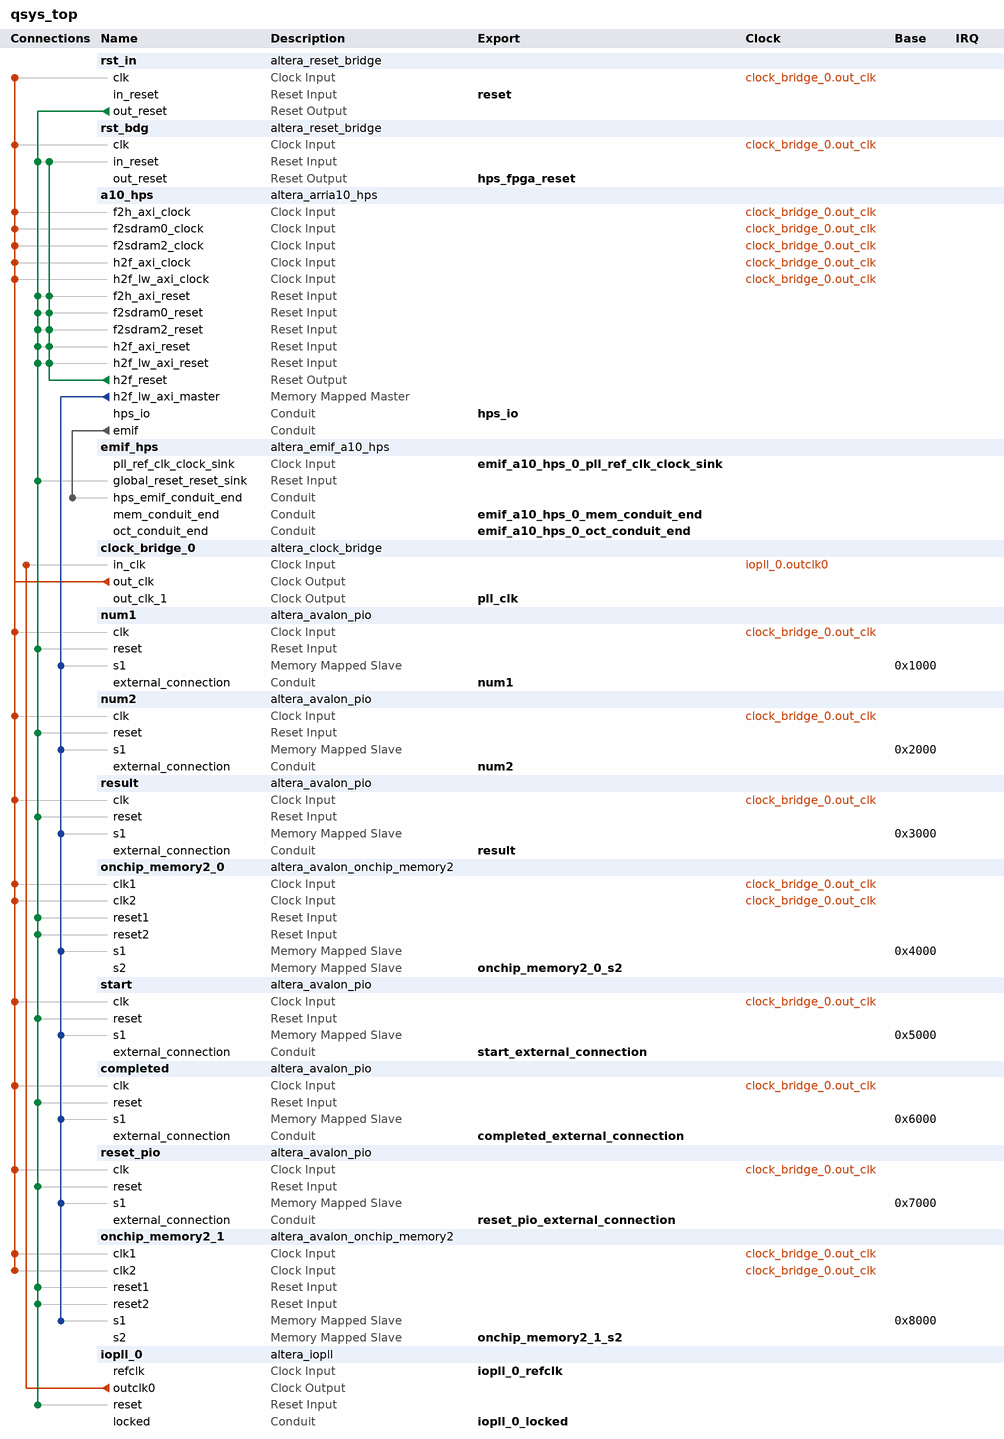
[diagram p0: system contents]
# Platform Designer (Qsys) system qsys_top, Arria 10 10AS066N3F40E2SG
# Parameters at their usual value, and those the tool derives, are not listed.
package require -exact qsys 1.0
create_system qsys_top
set_project_property DEVICE_FAMILY {Arria 10}
set_project_property DEVICE 10AS066N3F40E2SG

add_component rst_in ip/qsys_top/rst_in.ip altera_reset_bridge rst_in 18.1

add_component rst_bdg ip/qsys_top/rst_bdg.ip altera_reset_bridge rst_bdg 18.1
load_component rst_bdg
set_component_parameter_value ACTIVE_LOW_RESET 0
set_component_parameter_value SYNCHRONOUS_EDGES deassert
set_component_parameter_value SYNC_RESET 0
save_component

add_instance a10_hps altera_arria10_hps 18.1
set_instance_parameter_value a10_hps BOOT_FROM_FPGA_Enable false
set_instance_parameter_value a10_hps BSEL 1
set_instance_parameter_value a10_hps BSEL_EN false
set_instance_parameter_value a10_hps CLK_EMACA_SOURCE 1
set_instance_parameter_value a10_hps CLK_EMACB_SOURCE 1
set_instance_parameter_value a10_hps CLK_EMAC_PTP_SOURCE 1
set_instance_parameter_value a10_hps CLK_GPIO_SOURCE 1
set_instance_parameter_value a10_hps CLK_HMC_PLL_SOURCE 0
set_instance_parameter_value a10_hps CLK_MAIN_PLL_SOURCE2 0
set_instance_parameter_value a10_hps CLK_MPU_CNT 0
set_instance_parameter_value a10_hps CLK_MPU_SOURCE 0
set_instance_parameter_value a10_hps CLK_NOC_CNT 0
set_instance_parameter_value a10_hps CLK_NOC_SOURCE 0
set_instance_parameter_value a10_hps CLK_PERI_PLL_SOURCE2 0
set_instance_parameter_value a10_hps CLK_S2F_USER0_SOURCE 0
set_instance_parameter_value a10_hps CLK_S2F_USER1_SOURCE 0
set_instance_parameter_value a10_hps CLK_SDMMC_SOURCE 1
set_instance_parameter_value a10_hps CM_Mode N/A
set_instance_parameter_value a10_hps CM_PinMuxing Unused
set_instance_parameter_value a10_hps CTI_Enable false
set_instance_parameter_value a10_hps CUSTOM_MPU_CLK 1020
set_instance_parameter_value a10_hps DEBUG_APB_Enable false
set_instance_parameter_value a10_hps DISABLE_PERI_PLL false
set_instance_parameter_value a10_hps DMA_Enable No,No,No,No,No,No,No,No
set_instance_parameter_value a10_hps EMAC0_CLK 250
set_instance_parameter_value a10_hps EMAC0_Mode RGMII_with_MDIO
set_instance_parameter_value a10_hps EMAC0_PTP false
set_instance_parameter_value a10_hps EMAC0_PinMuxing IO
set_instance_parameter_value a10_hps EMAC0_SWITCH_Enable false
set_instance_parameter_value a10_hps EMAC1_CLK 250
set_instance_parameter_value a10_hps EMAC1_Mode N/A
set_instance_parameter_value a10_hps EMAC1_PTP false
set_instance_parameter_value a10_hps EMAC1_PinMuxing Unused
set_instance_parameter_value a10_hps EMAC1_SWITCH_Enable false
set_instance_parameter_value a10_hps EMAC2_CLK 250
set_instance_parameter_value a10_hps EMAC2_Mode N/A
set_instance_parameter_value a10_hps EMAC2_PTP false
set_instance_parameter_value a10_hps EMAC2_PinMuxing Unused
set_instance_parameter_value a10_hps EMAC2_SWITCH_Enable false
set_instance_parameter_value a10_hps EMAC_PTP_REF_CLK 100
set_instance_parameter_value a10_hps EMIF_BYPASS_CHECK false
set_instance_parameter_value a10_hps EMIF_CONDUIT_Enable true
set_instance_parameter_value a10_hps F2H_AXI_CLOCK_FREQ 140000000
set_instance_parameter_value a10_hps F2H_COLD_RST_Enable false
set_instance_parameter_value a10_hps F2H_DBG_RST_Enable false
set_instance_parameter_value a10_hps F2H_DELAY 3
set_instance_parameter_value a10_hps F2H_FREE_CLK_Enable false
set_instance_parameter_value a10_hps F2H_FREE_CLK_FREQ 200
set_instance_parameter_value a10_hps F2H_SDRAM0_CLOCK_FREQ 100
set_instance_parameter_value a10_hps F2H_SDRAM1_CLOCK_FREQ 100
set_instance_parameter_value a10_hps F2H_SDRAM2_CLOCK_FREQ 100
set_instance_parameter_value a10_hps F2H_SDRAM3_CLOCK_FREQ 100
set_instance_parameter_value a10_hps F2H_SDRAM4_CLOCK_FREQ 100
set_instance_parameter_value a10_hps F2H_SDRAM5_CLOCK_FREQ 100
set_instance_parameter_value a10_hps F2H_WARM_RST_Enable false
set_instance_parameter_value a10_hps F2SDRAM0_ENABLED true
set_instance_parameter_value a10_hps F2SDRAM1_ENABLED false
set_instance_parameter_value a10_hps F2SDRAM2_DELAY 4
set_instance_parameter_value a10_hps F2SDRAM2_ENABLED true
set_instance_parameter_value a10_hps F2SDRAM_ADDRESS_WIDTH 32
set_instance_parameter_value a10_hps F2SDRAM_PORT_CONFIG 6
set_instance_parameter_value a10_hps F2SDRAM_READY_LATENCY true
set_instance_parameter_value a10_hps F2SINTERRUPT_Enable false
set_instance_parameter_value a10_hps F2S_Width 6
set_instance_parameter_value a10_hps FPGA_PERIPHERAL_INPUT_CLOCK_FREQ_EMAC0_RX_CLK_IN 100
set_instance_parameter_value a10_hps FPGA_PERIPHERAL_INPUT_CLOCK_FREQ_EMAC0_TX_CLK_IN 100
set_instance_parameter_value a10_hps FPGA_PERIPHERAL_INPUT_CLOCK_FREQ_EMAC1_RX_CLK_IN 100
set_instance_parameter_value a10_hps FPGA_PERIPHERAL_INPUT_CLOCK_FREQ_EMAC1_TX_CLK_IN 100
set_instance_parameter_value a10_hps FPGA_PERIPHERAL_INPUT_CLOCK_FREQ_EMAC2_RX_CLK_IN 100
set_instance_parameter_value a10_hps FPGA_PERIPHERAL_INPUT_CLOCK_FREQ_EMAC2_TX_CLK_IN 100
set_instance_parameter_value a10_hps FPGA_PERIPHERAL_INPUT_CLOCK_FREQ_EMAC_PTP_REF_CLOCK 100
set_instance_parameter_value a10_hps FPGA_PERIPHERAL_INPUT_CLOCK_FREQ_I2C0_SCL_IN 100
set_instance_parameter_value a10_hps FPGA_PERIPHERAL_INPUT_CLOCK_FREQ_I2C1_SCL_IN 100
set_instance_parameter_value a10_hps FPGA_PERIPHERAL_INPUT_CLOCK_FREQ_I2CEMAC0_SCL_IN 100
set_instance_parameter_value a10_hps FPGA_PERIPHERAL_INPUT_CLOCK_FREQ_I2CEMAC1_SCL_IN 100
set_instance_parameter_value a10_hps FPGA_PERIPHERAL_INPUT_CLOCK_FREQ_I2CEMAC2_SCL_IN 100
set_instance_parameter_value a10_hps FPGA_PERIPHERAL_INPUT_CLOCK_FREQ_SDMMC_CLK_IN 100
set_instance_parameter_value a10_hps FPGA_PERIPHERAL_INPUT_CLOCK_FREQ_SPIS0_SCLK_IN 100
set_instance_parameter_value a10_hps FPGA_PERIPHERAL_INPUT_CLOCK_FREQ_SPIS1_SCLK_IN 100
set_instance_parameter_value a10_hps FPGA_PERIPHERAL_INPUT_CLOCK_FREQ_USB0_CLK_IN 100
set_instance_parameter_value a10_hps FPGA_PERIPHERAL_INPUT_CLOCK_FREQ_USB1_CLK_IN 100
set_instance_parameter_value a10_hps FPGA_PERIPHERAL_OUTPUT_CLOCK_FREQ_EMAC0_GTX_CLK 100
set_instance_parameter_value a10_hps FPGA_PERIPHERAL_OUTPUT_CLOCK_FREQ_EMAC0_MD_CLK 2.5
set_instance_parameter_value a10_hps FPGA_PERIPHERAL_OUTPUT_CLOCK_FREQ_EMAC1_GTX_CLK 125
set_instance_parameter_value a10_hps FPGA_PERIPHERAL_OUTPUT_CLOCK_FREQ_EMAC1_MD_CLK 2.5
set_instance_parameter_value a10_hps FPGA_PERIPHERAL_OUTPUT_CLOCK_FREQ_EMAC2_GTX_CLK 125
set_instance_parameter_value a10_hps FPGA_PERIPHERAL_OUTPUT_CLOCK_FREQ_EMAC2_MD_CLK 2.5
set_instance_parameter_value a10_hps FPGA_PERIPHERAL_OUTPUT_CLOCK_FREQ_I2C0_CLK 100
set_instance_parameter_value a10_hps FPGA_PERIPHERAL_OUTPUT_CLOCK_FREQ_I2C1_CLK 100
set_instance_parameter_value a10_hps FPGA_PERIPHERAL_OUTPUT_CLOCK_FREQ_I2CEMAC0_CLK 100
set_instance_parameter_value a10_hps FPGA_PERIPHERAL_OUTPUT_CLOCK_FREQ_I2CEMAC1_CLK 100
set_instance_parameter_value a10_hps FPGA_PERIPHERAL_OUTPUT_CLOCK_FREQ_I2CEMAC2_CLK 100
set_instance_parameter_value a10_hps FPGA_PERIPHERAL_OUTPUT_CLOCK_FREQ_QSPI_SCLK_OUT 100
set_instance_parameter_value a10_hps FPGA_PERIPHERAL_OUTPUT_CLOCK_FREQ_SDMMC_CCLK 100
set_instance_parameter_value a10_hps FPGA_PERIPHERAL_OUTPUT_CLOCK_FREQ_SPIM0_SCLK_OUT 100
set_instance_parameter_value a10_hps FPGA_PERIPHERAL_OUTPUT_CLOCK_FREQ_SPIM1_SCLK_OUT 100
set_instance_parameter_value a10_hps GPIO_REF_CLK 4
set_instance_parameter_value a10_hps GP_Enable false
set_instance_parameter_value a10_hps H2F_AXI_CLOCK_FREQ 140000000
set_instance_parameter_value a10_hps H2F_COLD_RST_Enable false
set_instance_parameter_value a10_hps H2F_CTI_CLOCK_FREQ 100
set_instance_parameter_value a10_hps H2F_DEBUG_APB_CLOCK_FREQ 100
set_instance_parameter_value a10_hps H2F_DELAY 3
set_instance_parameter_value a10_hps H2F_LW_AXI_CLOCK_FREQ 140000000
set_instance_parameter_value a10_hps H2F_LW_DELAY 3
set_instance_parameter_value a10_hps H2F_PENDING_RST_Enable false
set_instance_parameter_value a10_hps H2F_TPIU_CLOCK_IN_FREQ 100
set_instance_parameter_value a10_hps H2F_USER0_CLK_Enable false
set_instance_parameter_value a10_hps H2F_USER0_CLK_FREQ 400
set_instance_parameter_value a10_hps H2F_USER1_CLK_Enable false
set_instance_parameter_value a10_hps H2F_USER1_CLK_FREQ 400
set_instance_parameter_value a10_hps HMC_PLL_REF_CLK 800
set_instance_parameter_value a10_hps HPS_DIV_GPIO_FREQ 125
set_instance_parameter_value a10_hps HPS_IO_Enable SDMMC:D0,SDMMC:CMD,SDMMC:CCLK,SDMMC:D1,SDMMC:D2,SDMMC:D3,NONE,NONE,SDMMC:D4,SDMMC:D5,SDMMC:D6,SDMMC:D7,UART1:TX,UART1:RX,USB0:CLK,USB0:STP,USB0:DIR,USB0:DATA0,USB0:DATA1,USB0:NXT,USB0:DATA2,USB0:DATA3,USB0:DATA4,USB0:DATA5,USB0:DATA6,USB0:DATA7,EMAC0:TX_CLK,EMAC0:TX_CTL,EMAC0:RX_CLK,EMAC0:RX_CTL,EMAC0:TXD0,EMAC0:TXD1,EMAC0:RXD0,EMAC0:RXD1,EMAC0:TXD2,EMAC0:TXD3,EMAC0:RXD2,EMAC0:RXD3,SPIM1:CLK,SPIM1:MOSI,SPIM1:MISO,SPIM1:SS0_N,SPIM1:SS1_N,GPIO,NONE,NONE,NONE,NONE,MDIO0:MDIO,MDIO0:MDC,I2C1:SDA,I2C1:SCL,GPIO,TRACE:CLK,GPIO,GPIO,NONE,NONE,TRACE:D0,TRACE:D1,TRACE:D2,TRACE:D3
set_instance_parameter_value a10_hps I2C0_Mode N/A
set_instance_parameter_value a10_hps I2C0_PinMuxing Unused
set_instance_parameter_value a10_hps I2C1_Mode default
set_instance_parameter_value a10_hps I2C1_PinMuxing IO
set_instance_parameter_value a10_hps I2CEMAC0_Mode N/A
set_instance_parameter_value a10_hps I2CEMAC0_PinMuxing Unused
set_instance_parameter_value a10_hps I2CEMAC1_Mode N/A
set_instance_parameter_value a10_hps I2CEMAC1_PinMuxing Unused
set_instance_parameter_value a10_hps I2CEMAC2_Mode N/A
set_instance_parameter_value a10_hps I2CEMAC2_PinMuxing Unused
set_instance_parameter_value a10_hps INTERNAL_OSCILLATOR_ENABLE 60
set_instance_parameter_value a10_hps JTAG_Enable false
set_instance_parameter_value a10_hps L3_MAIN_FREE_CLK 200
set_instance_parameter_value a10_hps L4_SYS_FREE_CLK 1
set_instance_parameter_value a10_hps LWH2F_Enable 2
set_instance_parameter_value a10_hps MPU_CLK_VCCL 1
set_instance_parameter_value a10_hps MPU_EVENTS_Enable false
set_instance_parameter_value a10_hps NAND_Mode N/A
set_instance_parameter_value a10_hps NAND_PinMuxing Unused
set_instance_parameter_value a10_hps NOCDIV_CS_ATCLK 0
set_instance_parameter_value a10_hps NOCDIV_CS_PDBGCLK 1
set_instance_parameter_value a10_hps NOCDIV_CS_TRACECLK 1
set_instance_parameter_value a10_hps NOCDIV_L4MAINCLK 0
set_instance_parameter_value a10_hps NOCDIV_L4MPCLK 0
set_instance_parameter_value a10_hps NOCDIV_L4SPCLK 2
set_instance_parameter_value a10_hps OVERIDE_PERI_PLL false
set_instance_parameter_value a10_hps PERI_PLL_MANUAL_VCO_FREQ 2000
set_instance_parameter_value a10_hps PLL_CLK0 Unused
set_instance_parameter_value a10_hps PLL_CLK1 Unused
set_instance_parameter_value a10_hps PLL_CLK2 Unused
set_instance_parameter_value a10_hps PLL_CLK3 Unused
set_instance_parameter_value a10_hps PLL_CLK4 Unused
set_instance_parameter_value a10_hps QSPI_Mode N/A
set_instance_parameter_value a10_hps QSPI_PinMuxing Unused
set_instance_parameter_value a10_hps RUN_INTERNAL_BUILD_CHECKS 0
set_instance_parameter_value a10_hps S2FINTERRUPT_CLOCKPERIPHERAL_Enable false
set_instance_parameter_value a10_hps S2FINTERRUPT_CTI_Enable false
set_instance_parameter_value a10_hps S2FINTERRUPT_DMA_Enable false
set_instance_parameter_value a10_hps S2FINTERRUPT_EMAC0_Enable false
set_instance_parameter_value a10_hps S2FINTERRUPT_EMAC1_Enable false
set_instance_parameter_value a10_hps S2FINTERRUPT_EMAC2_Enable false
set_instance_parameter_value a10_hps S2FINTERRUPT_FPGAMANAGER_Enable false
set_instance_parameter_value a10_hps S2FINTERRUPT_GPIO_Enable false
set_instance_parameter_value a10_hps S2FINTERRUPT_HMC_Enable false
set_instance_parameter_value a10_hps S2FINTERRUPT_I2C0_Enable false
set_instance_parameter_value a10_hps S2FINTERRUPT_I2C1_Enable false
set_instance_parameter_value a10_hps S2FINTERRUPT_I2CEMAC0_Enable false
set_instance_parameter_value a10_hps S2FINTERRUPT_I2CEMAC1_Enable false
set_instance_parameter_value a10_hps S2FINTERRUPT_I2CEMAC2_Enable false
set_instance_parameter_value a10_hps S2FINTERRUPT_L4TIMER_Enable false
set_instance_parameter_value a10_hps S2FINTERRUPT_NAND_Enable false
set_instance_parameter_value a10_hps S2FINTERRUPT_QSPI_Enable false
set_instance_parameter_value a10_hps S2FINTERRUPT_SDMMC_Enable false
set_instance_parameter_value a10_hps S2FINTERRUPT_SPIM0_Enable false
set_instance_parameter_value a10_hps S2FINTERRUPT_SPIM1_Enable false
set_instance_parameter_value a10_hps S2FINTERRUPT_SPIS0_Enable false
set_instance_parameter_value a10_hps S2FINTERRUPT_SPIS1_Enable false
set_instance_parameter_value a10_hps S2FINTERRUPT_SYSTEMMANAGER_Enable false
set_instance_parameter_value a10_hps S2FINTERRUPT_SYSTIMER_Enable false
set_instance_parameter_value a10_hps S2FINTERRUPT_UART0_Enable false
set_instance_parameter_value a10_hps S2FINTERRUPT_UART1_Enable false
set_instance_parameter_value a10_hps S2FINTERRUPT_USB0_Enable false
set_instance_parameter_value a10_hps S2FINTERRUPT_USB1_Enable false
set_instance_parameter_value a10_hps S2FINTERRUPT_WATCHDOG_Enable false
set_instance_parameter_value a10_hps S2F_Width 4
set_instance_parameter_value a10_hps SDMMC_Mode 8-bit
set_instance_parameter_value a10_hps SDMMC_PinMuxing IO
set_instance_parameter_value a10_hps SDMMC_REF_CLK 200
set_instance_parameter_value a10_hps SECURITY_MODULE_Enable false
set_instance_parameter_value a10_hps SPIM0_Mode N/A
set_instance_parameter_value a10_hps SPIM0_PinMuxing Unused
set_instance_parameter_value a10_hps SPIM1_Mode Dual_slave_selects
set_instance_parameter_value a10_hps SPIM1_PinMuxing IO
set_instance_parameter_value a10_hps SPIS0_Mode N/A
set_instance_parameter_value a10_hps SPIS0_PinMuxing Unused
set_instance_parameter_value a10_hps SPIS1_Mode N/A
set_instance_parameter_value a10_hps SPIS1_PinMuxing Unused
set_instance_parameter_value a10_hps STM_Enable false
set_instance_parameter_value a10_hps TESTIOCTRL_DEBUGCLKSEL 16
set_instance_parameter_value a10_hps TESTIOCTRL_MAINCLKSEL 8
set_instance_parameter_value a10_hps TESTIOCTRL_PERICLKSEL 8
set_instance_parameter_value a10_hps TEST_Enable false
set_instance_parameter_value a10_hps TRACE_Mode default
set_instance_parameter_value a10_hps TRACE_PinMuxing IO
set_instance_parameter_value a10_hps UART0_Mode N/A
set_instance_parameter_value a10_hps UART0_PinMuxing Unused
set_instance_parameter_value a10_hps UART1_Mode No_flow_control
set_instance_parameter_value a10_hps UART1_PinMuxing IO
set_instance_parameter_value a10_hps USB0_Mode default
set_instance_parameter_value a10_hps USB0_PinMuxing IO
set_instance_parameter_value a10_hps USB1_Mode N/A
set_instance_parameter_value a10_hps USB1_PinMuxing Unused
set_instance_parameter_value a10_hps USE_DEFAULT_MPU_CLK false
set_instance_parameter_value a10_hps device_name 10AS066N3F40E2SG
set_instance_parameter_value a10_hps eosc1_clk_mhz 25.0
set_instance_parameter_value a10_hps quartus_ini_hps_ip_boot_from_fpga_ready false
set_instance_parameter_value a10_hps quartus_ini_hps_ip_enable_a10_advanced_options false
set_instance_parameter_value a10_hps quartus_ini_hps_ip_enable_jtag false
set_instance_parameter_value a10_hps quartus_ini_hps_ip_enable_sdmmc_clk_in false
set_instance_parameter_value a10_hps quartus_ini_hps_ip_enable_test_interface false
set_instance_parameter_value a10_hps quartus_ini_hps_ip_overide_f2sdram_delay false
set_instance_parameter_value a10_hps quartus_ini_hps_ip_override_sdmmc_4bit false

add_component emif_hps ip/qsys_top/emif_hps.ip altera_emif_a10_hps emif_hps 18.1
load_component emif_hps
set_component_parameter_value FAMILY_ENUM FAMILY_ARRIA10_HPS
set_component_parameter_value TRAIT_SUPPORTS_VID 0
set_component_parameter_value PROTOCOL_ENUM PROTOCOL_DDR4
set_component_parameter_value IS_ED_SLAVE false
set_component_parameter_value INTERNAL_TESTING_MODE false
set_component_parameter_value CAL_DEBUG_CLOCK_FREQUENCY 50000000
set_component_parameter_value PREV_PROTOCOL_ENUM PROTOCOL_DDR4
set_component_parameter_value PHY_FPGA_SPEEDGRADE_GUI {E2 (Production) - change device under 'View'->'Device Family'}
set_component_parameter_value PHY_TARGET_SPEEDGRADE E2
set_component_parameter_value PHY_TARGET_IS_ES false
set_component_parameter_value PHY_TARGET_IS_ES2 false
set_component_parameter_value PHY_TARGET_IS_ES3 false
set_component_parameter_value PHY_TARGET_IS_PRODUCTION true
set_component_parameter_value PHY_CONFIG_ENUM CONFIG_PHY_AND_HARD_CTRL
set_component_parameter_value PHY_PING_PONG_EN false
set_component_parameter_value PHY_RATE_ENUM RATE_HALF
set_component_parameter_value PHY_MEM_CLK_FREQ_MHZ 1066.667
set_component_parameter_value PHY_REF_CLK_FREQ_MHZ 133.333
set_component_parameter_value PHY_REF_CLK_JITTER_PS 10.0
set_component_parameter_value PHY_CORE_CLKS_SHARING_ENUM CORE_CLKS_SHARING_DISABLED
set_component_parameter_value PHY_CORE_CLKS_SHARING_EXPOSE_SLAVE_OUT false
set_component_parameter_value PHY_CALIBRATED_OCT true
set_component_parameter_value PHY_AC_CALIBRATED_OCT true
set_component_parameter_value PHY_CK_CALIBRATED_OCT true
set_component_parameter_value PHY_DATA_CALIBRATED_OCT true
set_component_parameter_value PHY_RZQ 240
set_component_parameter_value PHY_HPS_ENABLE_EARLY_RELEASE true
set_component_parameter_value PHY_USER_PERIODIC_OCT_RECAL_ENUM PERIODIC_OCT_RECAL_AUTO
set_component_parameter_value PHY_AC_IO_STD_ENUM IO_STD_SSTL_12
set_component_parameter_value PHY_CK_IO_STD_ENUM IO_STD_SSTL_12
set_component_parameter_value PHY_DATA_IO_STD_ENUM IO_STD_POD_12
set_component_parameter_value PHY_AC_MODE_ENUM OUT_OCT_40_CAL
set_component_parameter_value PHY_CK_MODE_ENUM OUT_OCT_40_CAL
set_component_parameter_value PHY_DATA_OUT_MODE_ENUM OUT_OCT_34_CAL
set_component_parameter_value PLL_ADD_EXTRA_CLKS false
set_component_parameter_value PLL_USER_NUM_OF_EXTRA_CLKS 0
set_component_parameter_value PLL_EXTRA_CLK_ACTUAL_FREQ_MHZ_GUI_0 0.0
set_component_parameter_value PLL_EXTRA_CLK_ACTUAL_PHASE_PS_GUI_0 0.0
set_component_parameter_value PLL_EXTRA_CLK_DESIRED_FREQ_MHZ_GUI_0 0.0
set_component_parameter_value PLL_EXTRA_CLK_PHASE_SHIFT_UNIT_GUI_0 ps
set_component_parameter_value PLL_EXTRA_CLK_DESIRED_PHASE_GUI_0 0.0
set_component_parameter_value PLL_EXTRA_CLK_ACTUAL_PHASE_DEG_GUI_0 0.0
set_component_parameter_value PLL_EXTRA_CLK_DESIRED_DUTY_CYCLE_GUI_0 50.0
set_component_parameter_value PLL_EXTRA_CLK_ACTUAL_DUTY_CYCLE_GUI_0 50.0
set_component_parameter_value PLL_EXTRA_CLK_ACTUAL_DUTY_CYCLE_0 50.0
set_component_parameter_value PLL_EXTRA_CLK_ACTUAL_FREQ_MHZ_GUI_1 0.0
set_component_parameter_value PLL_EXTRA_CLK_ACTUAL_PHASE_PS_GUI_1 0.0
set_component_parameter_value PLL_EXTRA_CLK_DESIRED_FREQ_MHZ_GUI_1 0.0
set_component_parameter_value PLL_EXTRA_CLK_PHASE_SHIFT_UNIT_GUI_1 ps
set_component_parameter_value PLL_EXTRA_CLK_DESIRED_PHASE_GUI_1 0.0
set_component_parameter_value PLL_EXTRA_CLK_ACTUAL_PHASE_DEG_GUI_1 0.0
set_component_parameter_value PLL_EXTRA_CLK_DESIRED_DUTY_CYCLE_GUI_1 50.0
set_component_parameter_value PLL_EXTRA_CLK_ACTUAL_DUTY_CYCLE_GUI_1 50.0
set_component_parameter_value PLL_EXTRA_CLK_ACTUAL_DUTY_CYCLE_1 50.0
set_component_parameter_value PLL_EXTRA_CLK_ACTUAL_FREQ_MHZ_GUI_2 0.0
set_component_parameter_value PLL_EXTRA_CLK_ACTUAL_PHASE_PS_GUI_2 0.0
set_component_parameter_value PLL_EXTRA_CLK_DESIRED_FREQ_MHZ_GUI_2 0.0
set_component_parameter_value PLL_EXTRA_CLK_PHASE_SHIFT_UNIT_GUI_2 ps
set_component_parameter_value PLL_EXTRA_CLK_DESIRED_PHASE_GUI_2 0.0
set_component_parameter_value PLL_EXTRA_CLK_ACTUAL_PHASE_DEG_GUI_2 0.0
set_component_parameter_value PLL_EXTRA_CLK_DESIRED_DUTY_CYCLE_GUI_2 50.0
set_component_parameter_value PLL_EXTRA_CLK_ACTUAL_DUTY_CYCLE_GUI_2 50.0
set_component_parameter_value PLL_EXTRA_CLK_ACTUAL_DUTY_CYCLE_2 50.0
set_component_parameter_value PLL_EXTRA_CLK_ACTUAL_FREQ_MHZ_GUI_3 0.0
set_component_parameter_value PLL_EXTRA_CLK_ACTUAL_PHASE_PS_GUI_3 0.0
set_component_parameter_value PLL_EXTRA_CLK_DESIRED_FREQ_MHZ_GUI_3 0.0
set_component_parameter_value PLL_EXTRA_CLK_PHASE_SHIFT_UNIT_GUI_3 ps
set_component_parameter_value PLL_EXTRA_CLK_DESIRED_PHASE_GUI_3 0.0
set_component_parameter_value PLL_EXTRA_CLK_ACTUAL_PHASE_DEG_GUI_3 0.0
set_component_parameter_value PLL_EXTRA_CLK_DESIRED_DUTY_CYCLE_GUI_3 50.0
set_component_parameter_value PLL_EXTRA_CLK_ACTUAL_DUTY_CYCLE_GUI_3 50.0
set_component_parameter_value PLL_EXTRA_CLK_ACTUAL_DUTY_CYCLE_3 50.0
set_component_parameter_value PLL_EXTRA_CLK_ACTUAL_FREQ_MHZ_GUI_4 0.0
set_component_parameter_value PLL_EXTRA_CLK_ACTUAL_PHASE_PS_GUI_4 0.0
set_component_parameter_value PLL_EXTRA_CLK_DESIRED_FREQ_MHZ_GUI_4 0.0
set_component_parameter_value PLL_EXTRA_CLK_PHASE_SHIFT_UNIT_GUI_4 ps
set_component_parameter_value PLL_EXTRA_CLK_DESIRED_PHASE_GUI_4 0.0
set_component_parameter_value PLL_EXTRA_CLK_ACTUAL_PHASE_DEG_GUI_4 0.0
set_component_parameter_value PLL_EXTRA_CLK_DESIRED_DUTY_CYCLE_GUI_4 50.0
set_component_parameter_value PLL_EXTRA_CLK_ACTUAL_DUTY_CYCLE_GUI_4 50.0
set_component_parameter_value PLL_EXTRA_CLK_ACTUAL_DUTY_CYCLE_4 50.0
set_component_parameter_value PLL_EXTRA_CLK_ACTUAL_FREQ_MHZ_GUI_5 0.0
set_component_parameter_value PLL_EXTRA_CLK_ACTUAL_PHASE_PS_GUI_5 0.0
set_component_parameter_value PLL_EXTRA_CLK_DESIRED_FREQ_MHZ_GUI_5 0.0
set_component_parameter_value PLL_EXTRA_CLK_PHASE_SHIFT_UNIT_GUI_5 ps
set_component_parameter_value PLL_EXTRA_CLK_DESIRED_PHASE_GUI_5 0.0
set_component_parameter_value PLL_EXTRA_CLK_ACTUAL_PHASE_DEG_GUI_5 0.0
set_component_parameter_value PLL_EXTRA_CLK_DESIRED_DUTY_CYCLE_GUI_5 50.0
set_component_parameter_value PLL_EXTRA_CLK_ACTUAL_DUTY_CYCLE_GUI_5 50.0
set_component_parameter_value PLL_EXTRA_CLK_ACTUAL_DUTY_CYCLE_5 50.0
set_component_parameter_value PLL_EXTRA_CLK_ACTUAL_FREQ_MHZ_GUI_6 0.0
set_component_parameter_value PLL_EXTRA_CLK_ACTUAL_PHASE_PS_GUI_6 0.0
set_component_parameter_value PLL_EXTRA_CLK_DESIRED_FREQ_MHZ_GUI_6 0.0
set_component_parameter_value PLL_EXTRA_CLK_PHASE_SHIFT_UNIT_GUI_6 ps
set_component_parameter_value PLL_EXTRA_CLK_DESIRED_PHASE_GUI_6 0.0
set_component_parameter_value PLL_EXTRA_CLK_ACTUAL_PHASE_DEG_GUI_6 0.0
set_component_parameter_value PLL_EXTRA_CLK_DESIRED_DUTY_CYCLE_GUI_6 50.0
set_component_parameter_value PLL_EXTRA_CLK_ACTUAL_DUTY_CYCLE_GUI_6 50.0
set_component_parameter_value PLL_EXTRA_CLK_ACTUAL_DUTY_CYCLE_6 50.0
set_component_parameter_value PLL_EXTRA_CLK_ACTUAL_FREQ_MHZ_GUI_7 0.0
set_component_parameter_value PLL_EXTRA_CLK_ACTUAL_PHASE_PS_GUI_7 0.0
set_component_parameter_value PLL_EXTRA_CLK_DESIRED_FREQ_MHZ_GUI_7 0.0
set_component_parameter_value PLL_EXTRA_CLK_PHASE_SHIFT_UNIT_GUI_7 ps
set_component_parameter_value PLL_EXTRA_CLK_DESIRED_PHASE_GUI_7 0.0
set_component_parameter_value PLL_EXTRA_CLK_ACTUAL_PHASE_DEG_GUI_7 0.0
set_component_parameter_value PLL_EXTRA_CLK_DESIRED_DUTY_CYCLE_GUI_7 50.0
set_component_parameter_value PLL_EXTRA_CLK_ACTUAL_DUTY_CYCLE_GUI_7 50.0
set_component_parameter_value PLL_EXTRA_CLK_ACTUAL_DUTY_CYCLE_7 50.0
set_component_parameter_value PLL_EXTRA_CLK_ACTUAL_FREQ_MHZ_GUI_8 0.0
set_component_parameter_value PLL_EXTRA_CLK_ACTUAL_PHASE_PS_GUI_8 0.0
set_component_parameter_value PLL_EXTRA_CLK_DESIRED_FREQ_MHZ_GUI_8 0.0
set_component_parameter_value PLL_EXTRA_CLK_PHASE_SHIFT_UNIT_GUI_8 ps
set_component_parameter_value PLL_EXTRA_CLK_DESIRED_PHASE_GUI_8 0.0
set_component_parameter_value PLL_EXTRA_CLK_ACTUAL_PHASE_DEG_GUI_8 0.0
set_component_parameter_value PLL_EXTRA_CLK_DESIRED_DUTY_CYCLE_GUI_8 50.0
set_component_parameter_value PLL_EXTRA_CLK_ACTUAL_DUTY_CYCLE_GUI_8 50.0
set_component_parameter_value PLL_EXTRA_CLK_ACTUAL_DUTY_CYCLE_8 50.0
set_component_parameter_value PLL_VCO_CLK_FREQ_MHZ 1066.667
set_component_parameter_value PLL_NUM_OF_EXTRA_CLKS 0
set_component_parameter_value PLL_EXTRA_CLK_ACTUAL_FREQ_MHZ_0 0.0
set_component_parameter_value PLL_EXTRA_CLK_ACTUAL_PHASE_PS_0 0.0
set_component_parameter_value PLL_EXTRA_CLK_ACTUAL_FREQ_MHZ_1 0.0
set_component_parameter_value PLL_EXTRA_CLK_ACTUAL_PHASE_PS_1 0.0
set_component_parameter_value PLL_EXTRA_CLK_ACTUAL_FREQ_MHZ_2 0.0
set_component_parameter_value PLL_EXTRA_CLK_ACTUAL_PHASE_PS_2 0.0
set_component_parameter_value PLL_EXTRA_CLK_ACTUAL_FREQ_MHZ_3 0.0
set_component_parameter_value PLL_EXTRA_CLK_ACTUAL_PHASE_PS_3 0.0
set_component_parameter_value PLL_EXTRA_CLK_ACTUAL_FREQ_MHZ_4 0.0
set_component_parameter_value PLL_EXTRA_CLK_ACTUAL_PHASE_PS_4 0.0
set_component_parameter_value PLL_EXTRA_CLK_ACTUAL_FREQ_MHZ_5 1066.667
set_component_parameter_value PLL_EXTRA_CLK_ACTUAL_PHASE_PS_5 0.0
set_component_parameter_value PLL_EXTRA_CLK_ACTUAL_FREQ_MHZ_6 1066.667
set_component_parameter_value PLL_EXTRA_CLK_ACTUAL_PHASE_PS_6 0.0
set_component_parameter_value PLL_EXTRA_CLK_ACTUAL_FREQ_MHZ_7 1066.667
set_component_parameter_value PLL_EXTRA_CLK_ACTUAL_PHASE_PS_7 0.0
set_component_parameter_value PLL_EXTRA_CLK_ACTUAL_FREQ_MHZ_8 1066.667
set_component_parameter_value PLL_EXTRA_CLK_ACTUAL_PHASE_PS_8 0.0
set_component_parameter_value PHY_DDR3_CONFIG_ENUM CONFIG_PHY_AND_HARD_CTRL
set_component_parameter_value PHY_DDR3_USER_PING_PONG_EN false
set_component_parameter_value PHY_DDR3_MEM_CLK_FREQ_MHZ 1066.667
set_component_parameter_value PHY_DDR3_DEFAULT_REF_CLK_FREQ true
set_component_parameter_value PHY_DDR3_USER_REF_CLK_FREQ_MHZ -1.0
set_component_parameter_value PHY_DDR3_REF_CLK_JITTER_PS 10.0
set_component_parameter_value PHY_DDR3_RATE_ENUM RATE_HALF
set_component_parameter_value PHY_DDR3_CORE_CLKS_SHARING_ENUM CORE_CLKS_SHARING_DISABLED
set_component_parameter_value PHY_DDR3_CORE_CLKS_SHARING_EXPOSE_SLAVE_OUT false
set_component_parameter_value PHY_DDR3_IO_VOLTAGE 1.5
set_component_parameter_value PHY_DDR3_DEFAULT_IO true
set_component_parameter_value PHY_DDR3_HPS_ENABLE_EARLY_RELEASE false
set_component_parameter_value PHY_DDR3_USER_PERIODIC_OCT_RECAL_ENUM PERIODIC_OCT_RECAL_AUTO
set_component_parameter_value PHY_DDR3_REF_CLK_FREQ_MHZ -1.0
set_component_parameter_value PHY_DDR3_PING_PONG_EN false
set_component_parameter_value PHY_DDR3_USER_AC_IO_STD_ENUM unset
set_component_parameter_value PHY_DDR3_USER_AC_MODE_ENUM unset
set_component_parameter_value PHY_DDR3_USER_AC_SLEW_RATE_ENUM SLEW_RATE_FAST
set_component_parameter_value PHY_DDR3_USER_CK_IO_STD_ENUM unset
set_component_parameter_value PHY_DDR3_USER_CK_MODE_ENUM unset
set_component_parameter_value PHY_DDR3_USER_CK_SLEW_RATE_ENUM SLEW_RATE_FAST
set_component_parameter_value PHY_DDR3_USER_DATA_IO_STD_ENUM unset
set_component_parameter_value PHY_DDR3_USER_DATA_OUT_MODE_ENUM unset
set_component_parameter_value PHY_DDR3_USER_DATA_IN_MODE_ENUM unset
set_component_parameter_value PHY_DDR3_USER_AUTO_STARTING_VREFIN_EN true
set_component_parameter_value PHY_DDR3_USER_STARTING_VREFIN 70.0
set_component_parameter_value PHY_DDR3_USER_PLL_REF_CLK_IO_STD_ENUM unset
set_component_parameter_value PHY_DDR3_USER_RZQ_IO_STD_ENUM unset
set_component_parameter_value PHY_DDR3_AC_IO_STD_ENUM unset
set_component_parameter_value PHY_DDR3_AC_MODE_ENUM unset
set_component_parameter_value PHY_DDR3_AC_SLEW_RATE_ENUM SLEW_RATE_FAST
set_component_parameter_value PHY_DDR3_CK_IO_STD_ENUM unset
set_component_parameter_value PHY_DDR3_CK_MODE_ENUM unset
set_component_parameter_value PHY_DDR3_CK_SLEW_RATE_ENUM SLEW_RATE_FAST
set_component_parameter_value PHY_DDR3_DATA_IO_STD_ENUM unset
set_component_parameter_value PHY_DDR3_DATA_OUT_MODE_ENUM unset
set_component_parameter_value PHY_DDR3_DATA_IN_MODE_ENUM unset
set_component_parameter_value PHY_DDR3_AUTO_STARTING_VREFIN_EN true
set_component_parameter_value PHY_DDR3_STARTING_VREFIN 70.0
set_component_parameter_value PHY_DDR3_PLL_REF_CLK_IO_STD_ENUM unset
set_component_parameter_value PHY_DDR3_RZQ_IO_STD_ENUM unset
set_component_parameter_value PHY_DDR3_CAL_ADDR0 0
set_component_parameter_value PHY_DDR3_CAL_ADDR1 8
set_component_parameter_value PHY_DDR3_CAL_ENABLE_NON_DES false
set_component_parameter_value PHY_DDR4_CONFIG_ENUM CONFIG_PHY_AND_HARD_CTRL
set_component_parameter_value PHY_DDR4_USER_PING_PONG_EN false
set_component_parameter_value PHY_DDR4_MEM_CLK_FREQ_MHZ 1066.667
set_component_parameter_value PHY_DDR4_DEFAULT_REF_CLK_FREQ false
set_component_parameter_value PHY_DDR4_USER_REF_CLK_FREQ_MHZ 133.333
set_component_parameter_value PHY_DDR4_REF_CLK_JITTER_PS 10.0
set_component_parameter_value PHY_DDR4_RATE_ENUM RATE_HALF
set_component_parameter_value PHY_DDR4_CORE_CLKS_SHARING_ENUM CORE_CLKS_SHARING_DISABLED
set_component_parameter_value PHY_DDR4_CORE_CLKS_SHARING_EXPOSE_SLAVE_OUT false
set_component_parameter_value PHY_DDR4_IO_VOLTAGE 1.2
set_component_parameter_value PHY_DDR4_DEFAULT_IO false
set_component_parameter_value PHY_DDR4_HPS_ENABLE_EARLY_RELEASE true
set_component_parameter_value PHY_DDR4_USER_PERIODIC_OCT_RECAL_ENUM PERIODIC_OCT_RECAL_AUTO
set_component_parameter_value PHY_DDR4_REF_CLK_FREQ_MHZ 133.333
set_component_parameter_value PHY_DDR4_PING_PONG_EN false
set_component_parameter_value PHY_DDR4_USER_AC_IO_STD_ENUM IO_STD_SSTL_12
set_component_parameter_value PHY_DDR4_USER_AC_MODE_ENUM OUT_OCT_40_CAL
set_component_parameter_value PHY_DDR4_USER_AC_SLEW_RATE_ENUM SLEW_RATE_FAST
set_component_parameter_value PHY_DDR4_USER_CK_IO_STD_ENUM IO_STD_SSTL_12
set_component_parameter_value PHY_DDR4_USER_CK_MODE_ENUM OUT_OCT_40_CAL
set_component_parameter_value PHY_DDR4_USER_CK_SLEW_RATE_ENUM SLEW_RATE_FAST
set_component_parameter_value PHY_DDR4_USER_DATA_IO_STD_ENUM IO_STD_POD_12
set_component_parameter_value PHY_DDR4_USER_DATA_OUT_MODE_ENUM OUT_OCT_34_CAL
set_component_parameter_value PHY_DDR4_USER_DATA_IN_MODE_ENUM IN_OCT_60_CAL
set_component_parameter_value PHY_DDR4_USER_AUTO_STARTING_VREFIN_EN true
set_component_parameter_value PHY_DDR4_USER_STARTING_VREFIN 70.0
set_component_parameter_value PHY_DDR4_USER_PLL_REF_CLK_IO_STD_ENUM IO_STD_LVDS
set_component_parameter_value PHY_DDR4_USER_RZQ_IO_STD_ENUM IO_STD_CMOS_12
set_component_parameter_value PHY_DDR4_AC_IO_STD_ENUM IO_STD_SSTL_12
set_component_parameter_value PHY_DDR4_AC_MODE_ENUM OUT_OCT_40_CAL
set_component_parameter_value PHY_DDR4_AC_SLEW_RATE_ENUM SLEW_RATE_FAST
set_component_parameter_value PHY_DDR4_CK_IO_STD_ENUM IO_STD_SSTL_12
set_component_parameter_value PHY_DDR4_CK_MODE_ENUM OUT_OCT_40_CAL
set_component_parameter_value PHY_DDR4_CK_SLEW_RATE_ENUM SLEW_RATE_FAST
set_component_parameter_value PHY_DDR4_DATA_IO_STD_ENUM IO_STD_POD_12
set_component_parameter_value PHY_DDR4_DATA_OUT_MODE_ENUM OUT_OCT_34_CAL
set_component_parameter_value PHY_DDR4_DATA_IN_MODE_ENUM IN_OCT_60_CAL
set_component_parameter_value PHY_DDR4_AUTO_STARTING_VREFIN_EN true
set_component_parameter_value PHY_DDR4_STARTING_VREFIN 68.0
set_component_parameter_value PHY_DDR4_PLL_REF_CLK_IO_STD_ENUM IO_STD_LVDS
set_component_parameter_value PHY_DDR4_RZQ_IO_STD_ENUM IO_STD_CMOS_12
set_component_parameter_value PHY_QDR2_CONFIG_ENUM CONFIG_PHY_AND_SOFT_CTRL
set_component_parameter_value PHY_QDR2_USER_PING_PONG_EN false
set_component_parameter_value PHY_QDR2_MEM_CLK_FREQ_MHZ 633.333
set_component_parameter_value PHY_QDR2_DEFAULT_REF_CLK_FREQ true
set_component_parameter_value PHY_QDR2_USER_REF_CLK_FREQ_MHZ -1.0
set_component_parameter_value PHY_QDR2_REF_CLK_JITTER_PS 10.0
set_component_parameter_value PHY_QDR2_RATE_ENUM RATE_HALF
set_component_parameter_value PHY_QDR2_CORE_CLKS_SHARING_ENUM CORE_CLKS_SHARING_DISABLED
set_component_parameter_value PHY_QDR2_CORE_CLKS_SHARING_EXPOSE_SLAVE_OUT false
set_component_parameter_value PHY_QDR2_IO_VOLTAGE 1.5
set_component_parameter_value PHY_QDR2_DEFAULT_IO true
set_component_parameter_value PHY_QDR2_HPS_ENABLE_EARLY_RELEASE false
set_component_parameter_value PHY_QDR2_USER_PERIODIC_OCT_RECAL_ENUM PERIODIC_OCT_RECAL_AUTO
set_component_parameter_value PHY_QDR2_REF_CLK_FREQ_MHZ -1.0
set_component_parameter_value PHY_QDR2_PING_PONG_EN false
set_component_parameter_value PHY_QDR2_USER_AC_IO_STD_ENUM unset
set_component_parameter_value PHY_QDR2_USER_AC_MODE_ENUM unset
set_component_parameter_value PHY_QDR2_USER_AC_SLEW_RATE_ENUM SLEW_RATE_FAST
set_component_parameter_value PHY_QDR2_USER_CK_IO_STD_ENUM unset
set_component_parameter_value PHY_QDR2_USER_CK_MODE_ENUM unset
set_component_parameter_value PHY_QDR2_USER_CK_SLEW_RATE_ENUM SLEW_RATE_FAST
set_component_parameter_value PHY_QDR2_USER_DATA_IO_STD_ENUM unset
set_component_parameter_value PHY_QDR2_USER_DATA_OUT_MODE_ENUM unset
set_component_parameter_value PHY_QDR2_USER_DATA_IN_MODE_ENUM unset
set_component_parameter_value PHY_QDR2_USER_AUTO_STARTING_VREFIN_EN true
set_component_parameter_value PHY_QDR2_USER_STARTING_VREFIN 70.0
set_component_parameter_value PHY_QDR2_USER_PLL_REF_CLK_IO_STD_ENUM unset
set_component_parameter_value PHY_QDR2_USER_RZQ_IO_STD_ENUM unset
set_component_parameter_value PHY_QDR2_AC_IO_STD_ENUM unset
set_component_parameter_value PHY_QDR2_AC_MODE_ENUM unset
set_component_parameter_value PHY_QDR2_AC_SLEW_RATE_ENUM SLEW_RATE_FAST
set_component_parameter_value PHY_QDR2_CK_IO_STD_ENUM unset
set_component_parameter_value PHY_QDR2_CK_MODE_ENUM unset
set_component_parameter_value PHY_QDR2_CK_SLEW_RATE_ENUM SLEW_RATE_FAST
set_component_parameter_value PHY_QDR2_DATA_IO_STD_ENUM unset
set_component_parameter_value PHY_QDR2_DATA_OUT_MODE_ENUM unset
set_component_parameter_value PHY_QDR2_DATA_IN_MODE_ENUM unset
set_component_parameter_value PHY_QDR2_AUTO_STARTING_VREFIN_EN true
set_component_parameter_value PHY_QDR2_STARTING_VREFIN 70.0
set_component_parameter_value PHY_QDR2_PLL_REF_CLK_IO_STD_ENUM unset
set_component_parameter_value PHY_QDR2_RZQ_IO_STD_ENUM unset
set_component_parameter_value PHY_QDR4_CONFIG_ENUM CONFIG_PHY_AND_SOFT_CTRL
set_component_parameter_value PHY_QDR4_USER_PING_PONG_EN false
set_component_parameter_value PHY_QDR4_MEM_CLK_FREQ_MHZ 1066.667
set_component_parameter_value PHY_QDR4_DEFAULT_REF_CLK_FREQ true
set_component_parameter_value PHY_QDR4_USER_REF_CLK_FREQ_MHZ -1.0
set_component_parameter_value PHY_QDR4_REF_CLK_JITTER_PS 10.0
set_component_parameter_value PHY_QDR4_RATE_ENUM RATE_QUARTER
set_component_parameter_value PHY_QDR4_CORE_CLKS_SHARING_ENUM CORE_CLKS_SHARING_DISABLED
set_component_parameter_value PHY_QDR4_CORE_CLKS_SHARING_EXPOSE_SLAVE_OUT false
set_component_parameter_value PHY_QDR4_IO_VOLTAGE 1.2
set_component_parameter_value PHY_QDR4_DEFAULT_IO true
set_component_parameter_value PHY_QDR4_HPS_ENABLE_EARLY_RELEASE false
set_component_parameter_value PHY_QDR4_USER_PERIODIC_OCT_RECAL_ENUM PERIODIC_OCT_RECAL_AUTO
set_component_parameter_value PHY_QDR4_REF_CLK_FREQ_MHZ -1.0
set_component_parameter_value PHY_QDR4_PING_PONG_EN false
set_component_parameter_value PHY_QDR4_USER_AC_IO_STD_ENUM unset
set_component_parameter_value PHY_QDR4_USER_AC_MODE_ENUM unset
set_component_parameter_value PHY_QDR4_USER_AC_SLEW_RATE_ENUM SLEW_RATE_FAST
set_component_parameter_value PHY_QDR4_USER_CK_IO_STD_ENUM unset
set_component_parameter_value PHY_QDR4_USER_CK_MODE_ENUM unset
set_component_parameter_value PHY_QDR4_USER_CK_SLEW_RATE_ENUM SLEW_RATE_FAST
set_component_parameter_value PHY_QDR4_USER_DATA_IO_STD_ENUM unset
set_component_parameter_value PHY_QDR4_USER_DATA_OUT_MODE_ENUM unset
set_component_parameter_value PHY_QDR4_USER_DATA_IN_MODE_ENUM unset
set_component_parameter_value PHY_QDR4_USER_AUTO_STARTING_VREFIN_EN true
set_component_parameter_value PHY_QDR4_USER_STARTING_VREFIN 70.0
set_component_parameter_value PHY_QDR4_USER_PLL_REF_CLK_IO_STD_ENUM unset
set_component_parameter_value PHY_QDR4_USER_RZQ_IO_STD_ENUM unset
set_component_parameter_value PHY_QDR4_AC_IO_STD_ENUM unset
set_component_parameter_value PHY_QDR4_AC_MODE_ENUM unset
set_component_parameter_value PHY_QDR4_AC_SLEW_RATE_ENUM SLEW_RATE_FAST
set_component_parameter_value PHY_QDR4_CK_IO_STD_ENUM unset
set_component_parameter_value PHY_QDR4_CK_MODE_ENUM unset
set_component_parameter_value PHY_QDR4_CK_SLEW_RATE_ENUM SLEW_RATE_FAST
set_component_parameter_value PHY_QDR4_DATA_IO_STD_ENUM unset
set_component_parameter_value PHY_QDR4_DATA_OUT_MODE_ENUM unset
set_component_parameter_value PHY_QDR4_DATA_IN_MODE_ENUM unset
set_component_parameter_value PHY_QDR4_AUTO_STARTING_VREFIN_EN true
set_component_parameter_value PHY_QDR4_STARTING_VREFIN 70.0
set_component_parameter_value PHY_QDR4_PLL_REF_CLK_IO_STD_ENUM unset
set_component_parameter_value PHY_QDR4_RZQ_IO_STD_ENUM unset
set_component_parameter_value PHY_RLD2_CONFIG_ENUM CONFIG_PHY_AND_SOFT_CTRL
set_component_parameter_value PHY_RLD2_USER_PING_PONG_EN false
set_component_parameter_value PHY_RLD2_MEM_CLK_FREQ_MHZ 533.333
set_component_parameter_value PHY_RLD2_DEFAULT_REF_CLK_FREQ true
set_component_parameter_value PHY_RLD2_USER_REF_CLK_FREQ_MHZ -1.0
set_component_parameter_value PHY_RLD2_REF_CLK_JITTER_PS 10.0
set_component_parameter_value PHY_RLD2_RATE_ENUM RATE_HALF
set_component_parameter_value PHY_RLD2_CORE_CLKS_SHARING_ENUM CORE_CLKS_SHARING_DISABLED
set_component_parameter_value PHY_RLD2_CORE_CLKS_SHARING_EXPOSE_SLAVE_OUT false
set_component_parameter_value PHY_RLD2_IO_VOLTAGE 1.8
set_component_parameter_value PHY_RLD2_DEFAULT_IO true
set_component_parameter_value PHY_RLD2_HPS_ENABLE_EARLY_RELEASE false
set_component_parameter_value PHY_RLD2_USER_PERIODIC_OCT_RECAL_ENUM PERIODIC_OCT_RECAL_AUTO
set_component_parameter_value PHY_RLD2_REF_CLK_FREQ_MHZ -1.0
set_component_parameter_value PHY_RLD2_PING_PONG_EN false
set_component_parameter_value PHY_RLD2_USER_AC_IO_STD_ENUM unset
set_component_parameter_value PHY_RLD2_USER_AC_MODE_ENUM unset
set_component_parameter_value PHY_RLD2_USER_AC_SLEW_RATE_ENUM SLEW_RATE_FAST
set_component_parameter_value PHY_RLD2_USER_CK_IO_STD_ENUM unset
set_component_parameter_value PHY_RLD2_USER_CK_MODE_ENUM unset
set_component_parameter_value PHY_RLD2_USER_CK_SLEW_RATE_ENUM SLEW_RATE_FAST
set_component_parameter_value PHY_RLD2_USER_DATA_IO_STD_ENUM unset
set_component_parameter_value PHY_RLD2_USER_DATA_OUT_MODE_ENUM unset
set_component_parameter_value PHY_RLD2_USER_DATA_IN_MODE_ENUM unset
set_component_parameter_value PHY_RLD2_USER_AUTO_STARTING_VREFIN_EN true
set_component_parameter_value PHY_RLD2_USER_STARTING_VREFIN 70.0
set_component_parameter_value PHY_RLD2_USER_PLL_REF_CLK_IO_STD_ENUM unset
set_component_parameter_value PHY_RLD2_USER_RZQ_IO_STD_ENUM unset
set_component_parameter_value PHY_RLD2_AC_IO_STD_ENUM unset
set_component_parameter_value PHY_RLD2_AC_MODE_ENUM unset
set_component_parameter_value PHY_RLD2_AC_SLEW_RATE_ENUM SLEW_RATE_FAST
set_component_parameter_value PHY_RLD2_CK_IO_STD_ENUM unset
set_component_parameter_value PHY_RLD2_CK_MODE_ENUM unset
set_component_parameter_value PHY_RLD2_CK_SLEW_RATE_ENUM SLEW_RATE_FAST
set_component_parameter_value PHY_RLD2_DATA_IO_STD_ENUM unset
set_component_parameter_value PHY_RLD2_DATA_OUT_MODE_ENUM unset
set_component_parameter_value PHY_RLD2_DATA_IN_MODE_ENUM unset
set_component_parameter_value PHY_RLD2_AUTO_STARTING_VREFIN_EN true
set_component_parameter_value PHY_RLD2_STARTING_VREFIN 70.0
set_component_parameter_value PHY_RLD2_PLL_REF_CLK_IO_STD_ENUM unset
set_component_parameter_value PHY_RLD2_RZQ_IO_STD_ENUM unset
set_component_parameter_value PHY_RLD3_CONFIG_ENUM CONFIG_PHY_ONLY
set_component_parameter_value PHY_RLD3_USER_PING_PONG_EN false
set_component_parameter_value PHY_RLD3_MEM_CLK_FREQ_MHZ 1066.667
set_component_parameter_value PHY_RLD3_DEFAULT_REF_CLK_FREQ true
set_component_parameter_value PHY_RLD3_USER_REF_CLK_FREQ_MHZ -1.0
set_component_parameter_value PHY_RLD3_REF_CLK_JITTER_PS 10.0
set_component_parameter_value PHY_RLD3_RATE_ENUM RATE_QUARTER
set_component_parameter_value PHY_RLD3_CORE_CLKS_SHARING_ENUM CORE_CLKS_SHARING_DISABLED
set_component_parameter_value PHY_RLD3_CORE_CLKS_SHARING_EXPOSE_SLAVE_OUT false
set_component_parameter_value PHY_RLD3_IO_VOLTAGE 1.2
set_component_parameter_value PHY_RLD3_DEFAULT_IO true
set_component_parameter_value PHY_RLD3_HPS_ENABLE_EARLY_RELEASE false
set_component_parameter_value PHY_RLD3_USER_PERIODIC_OCT_RECAL_ENUM PERIODIC_OCT_RECAL_AUTO
set_component_parameter_value PHY_RLD3_REF_CLK_FREQ_MHZ -1.0
set_component_parameter_value PHY_RLD3_PING_PONG_EN false
set_component_parameter_value PHY_RLD3_USER_AC_IO_STD_ENUM unset
set_component_parameter_value PHY_RLD3_USER_AC_MODE_ENUM unset
set_component_parameter_value PHY_RLD3_USER_AC_SLEW_RATE_ENUM SLEW_RATE_FAST
set_component_parameter_value PHY_RLD3_USER_CK_IO_STD_ENUM unset
set_component_parameter_value PHY_RLD3_USER_CK_MODE_ENUM unset
set_component_parameter_value PHY_RLD3_USER_CK_SLEW_RATE_ENUM SLEW_RATE_FAST
set_component_parameter_value PHY_RLD3_USER_DATA_IO_STD_ENUM unset
set_component_parameter_value PHY_RLD3_USER_DATA_OUT_MODE_ENUM unset
set_component_parameter_value PHY_RLD3_USER_DATA_IN_MODE_ENUM unset
set_component_parameter_value PHY_RLD3_USER_AUTO_STARTING_VREFIN_EN true
set_component_parameter_value PHY_RLD3_USER_STARTING_VREFIN 70.0
set_component_parameter_value PHY_RLD3_USER_PLL_REF_CLK_IO_STD_ENUM unset
set_component_parameter_value PHY_RLD3_USER_RZQ_IO_STD_ENUM unset
set_component_parameter_value PHY_RLD3_AC_IO_STD_ENUM unset
set_component_parameter_value PHY_RLD3_AC_MODE_ENUM unset
set_component_parameter_value PHY_RLD3_AC_SLEW_RATE_ENUM SLEW_RATE_FAST
set_component_parameter_value PHY_RLD3_CK_IO_STD_ENUM unset
set_component_parameter_value PHY_RLD3_CK_MODE_ENUM unset
set_component_parameter_value PHY_RLD3_CK_SLEW_RATE_ENUM SLEW_RATE_FAST
set_component_parameter_value PHY_RLD3_DATA_IO_STD_ENUM unset
set_component_parameter_value PHY_RLD3_DATA_OUT_MODE_ENUM unset
set_component_parameter_value PHY_RLD3_DATA_IN_MODE_ENUM unset
set_component_parameter_value PHY_RLD3_AUTO_STARTING_VREFIN_EN true
set_component_parameter_value PHY_RLD3_STARTING_VREFIN 70.0
set_component_parameter_value PHY_RLD3_PLL_REF_CLK_IO_STD_ENUM unset
set_component_parameter_value PHY_RLD3_RZQ_IO_STD_ENUM unset
set_component_parameter_value PHY_LPDDR3_CONFIG_ENUM CONFIG_PHY_AND_HARD_CTRL
set_component_parameter_value PHY_LPDDR3_USER_PING_PONG_EN false
set_component_parameter_value PHY_LPDDR3_MEM_CLK_FREQ_MHZ 800.0
set_component_parameter_value PHY_LPDDR3_DEFAULT_REF_CLK_FREQ true
set_component_parameter_value PHY_LPDDR3_USER_REF_CLK_FREQ_MHZ -1.0
set_component_parameter_value PHY_LPDDR3_REF_CLK_JITTER_PS 10.0
set_component_parameter_value PHY_LPDDR3_RATE_ENUM RATE_HALF
set_component_parameter_value PHY_LPDDR3_CORE_CLKS_SHARING_ENUM CORE_CLKS_SHARING_DISABLED
set_component_parameter_value PHY_LPDDR3_CORE_CLKS_SHARING_EXPOSE_SLAVE_OUT false
set_component_parameter_value PHY_LPDDR3_IO_VOLTAGE 1.2
set_component_parameter_value PHY_LPDDR3_DEFAULT_IO true
set_component_parameter_value PHY_LPDDR3_HPS_ENABLE_EARLY_RELEASE false
set_component_parameter_value PHY_LPDDR3_USER_PERIODIC_OCT_RECAL_ENUM PERIODIC_OCT_RECAL_AUTO
set_component_parameter_value PHY_LPDDR3_REF_CLK_FREQ_MHZ -1.0
set_component_parameter_value PHY_LPDDR3_PING_PONG_EN false
set_component_parameter_value PHY_LPDDR3_USER_AC_IO_STD_ENUM unset
set_component_parameter_value PHY_LPDDR3_USER_AC_MODE_ENUM unset
set_component_parameter_value PHY_LPDDR3_USER_AC_SLEW_RATE_ENUM SLEW_RATE_FAST
set_component_parameter_value PHY_LPDDR3_USER_CK_IO_STD_ENUM unset
set_component_parameter_value PHY_LPDDR3_USER_CK_MODE_ENUM unset
set_component_parameter_value PHY_LPDDR3_USER_CK_SLEW_RATE_ENUM SLEW_RATE_FAST
set_component_parameter_value PHY_LPDDR3_USER_DATA_IO_STD_ENUM unset
set_component_parameter_value PHY_LPDDR3_USER_DATA_OUT_MODE_ENUM unset
set_component_parameter_value PHY_LPDDR3_USER_DATA_IN_MODE_ENUM unset
set_component_parameter_value PHY_LPDDR3_USER_AUTO_STARTING_VREFIN_EN true
set_component_parameter_value PHY_LPDDR3_USER_STARTING_VREFIN 70.0
set_component_parameter_value PHY_LPDDR3_USER_PLL_REF_CLK_IO_STD_ENUM unset
set_component_parameter_value PHY_LPDDR3_USER_RZQ_IO_STD_ENUM unset
set_component_parameter_value PHY_LPDDR3_AC_IO_STD_ENUM unset
set_component_parameter_value PHY_LPDDR3_AC_MODE_ENUM unset
set_component_parameter_value PHY_LPDDR3_AC_SLEW_RATE_ENUM SLEW_RATE_FAST
set_component_parameter_value PHY_LPDDR3_CK_IO_STD_ENUM unset
set_component_parameter_value PHY_LPDDR3_CK_MODE_ENUM unset
set_component_parameter_value PHY_LPDDR3_CK_SLEW_RATE_ENUM SLEW_RATE_FAST
set_component_parameter_value PHY_LPDDR3_DATA_IO_STD_ENUM unset
set_component_parameter_value PHY_LPDDR3_DATA_OUT_MODE_ENUM unset
set_component_parameter_value PHY_LPDDR3_DATA_IN_MODE_ENUM unset
set_component_parameter_value PHY_LPDDR3_AUTO_STARTING_VREFIN_EN true
set_component_parameter_value PHY_LPDDR3_STARTING_VREFIN 70.0
set_component_parameter_value PHY_LPDDR3_PLL_REF_CLK_IO_STD_ENUM unset
set_component_parameter_value PHY_LPDDR3_RZQ_IO_STD_ENUM unset
set_component_parameter_value MEM_FORMAT_ENUM MEM_FORMAT_UDIMM
set_component_parameter_value MEM_READ_LATENCY 16.0
set_component_parameter_value MEM_WRITE_LATENCY 11
set_component_parameter_value MEM_BURST_LENGTH 8
set_component_parameter_value MEM_DATA_MASK_EN true
set_component_parameter_value MEM_HAS_SIM_SUPPORT false
set_component_parameter_value MEM_NUM_OF_PHYSICAL_RANKS 1
set_component_parameter_value MEM_NUM_OF_LOGICAL_RANKS 1
set_component_parameter_value MEM_NUM_OF_DATA_ENDPOINTS 1
set_component_parameter_value MEM_TTL_DATA_WIDTH 32
set_component_parameter_value MEM_TTL_NUM_OF_READ_GROUPS 4
set_component_parameter_value MEM_TTL_NUM_OF_WRITE_GROUPS 4
set_component_parameter_value MEM_DDR3_FORMAT_ENUM MEM_FORMAT_UDIMM
set_component_parameter_value MEM_DDR3_DQ_WIDTH 32
set_component_parameter_value MEM_DDR3_DQ_PER_DQS 8
set_component_parameter_value MEM_DDR3_DISCRETE_CS_WIDTH 1
set_component_parameter_value MEM_DDR3_NUM_OF_DIMMS 1
set_component_parameter_value MEM_DDR3_RANKS_PER_DIMM 1
set_component_parameter_value MEM_DDR3_CKE_PER_DIMM 1
set_component_parameter_value MEM_DDR3_CK_WIDTH 1
set_component_parameter_value MEM_DDR3_ROW_ADDR_WIDTH 15
set_component_parameter_value MEM_DDR3_COL_ADDR_WIDTH 10
set_component_parameter_value MEM_DDR3_BANK_ADDR_WIDTH 3
set_component_parameter_value MEM_DDR3_DM_EN true
set_component_parameter_value MEM_DDR3_DISCRETE_MIRROR_ADDRESSING_EN false
set_component_parameter_value MEM_DDR3_MIRROR_ADDRESSING_EN true
set_component_parameter_value MEM_DDR3_HIDE_ADV_MR_SETTINGS true
set_component_parameter_value MEM_DDR3_RDIMM_CONFIG 0000000000000000
set_component_parameter_value MEM_DDR3_LRDIMM_EXTENDED_CONFIG 000000000000000000
set_component_parameter_value MEM_DDR3_ALERT_N_PLACEMENT_ENUM DDR3_ALERT_N_PLACEMENT_AC_LANES
set_component_parameter_value MEM_DDR3_ALERT_N_DQS_GROUP 0
set_component_parameter_value MEM_DDR3_DQS_WIDTH 8
set_component_parameter_value MEM_DDR3_DM_WIDTH 1
set_component_parameter_value MEM_DDR3_CS_WIDTH 1
set_component_parameter_value MEM_DDR3_CS_PER_DIMM 1
set_component_parameter_value MEM_DDR3_CKE_WIDTH 1
set_component_parameter_value MEM_DDR3_ODT_WIDTH 1
set_component_parameter_value MEM_DDR3_ADDR_WIDTH 1
set_component_parameter_value MEM_DDR3_RM_WIDTH 0
set_component_parameter_value MEM_DDR3_AC_PAR_EN false
set_component_parameter_value MEM_DDR3_NUM_OF_PHYSICAL_RANKS 1
set_component_parameter_value MEM_DDR3_NUM_OF_LOGICAL_RANKS 1
set_component_parameter_value MEM_DDR3_TTL_DQS_WIDTH 8
set_component_parameter_value MEM_DDR3_TTL_DQ_WIDTH 72
set_component_parameter_value MEM_DDR3_TTL_DM_WIDTH 1
set_component_parameter_value MEM_DDR3_TTL_CS_WIDTH 1
set_component_parameter_value MEM_DDR3_TTL_CK_WIDTH 1
set_component_parameter_value MEM_DDR3_TTL_CKE_WIDTH 1
set_component_parameter_value MEM_DDR3_TTL_ODT_WIDTH 1
set_component_parameter_value MEM_DDR3_TTL_BANK_ADDR_WIDTH 3
set_component_parameter_value MEM_DDR3_TTL_ADDR_WIDTH 1
set_component_parameter_value MEM_DDR3_TTL_RM_WIDTH 0
set_component_parameter_value MEM_DDR3_TTL_NUM_OF_DIMMS 1
set_component_parameter_value MEM_DDR3_TTL_NUM_OF_PHYSICAL_RANKS 1
set_component_parameter_value MEM_DDR3_TTL_NUM_OF_LOGICAL_RANKS 1
set_component_parameter_value MEM_DDR3_MR0 0
set_component_parameter_value MEM_DDR3_MR1 0
set_component_parameter_value MEM_DDR3_MR2 0
set_component_parameter_value MEM_DDR3_MR3 0
set_component_parameter_value MEM_DDR3_ADDRESS_MIRROR_BITVEC 0
set_component_parameter_value MEM_DDR3_BL_ENUM DDR3_BL_BL8
set_component_parameter_value MEM_DDR3_BT_ENUM DDR3_BT_SEQUENTIAL
set_component_parameter_value MEM_DDR3_ASR_ENUM DDR3_ASR_MANUAL
set_component_parameter_value MEM_DDR3_SRT_ENUM DDR3_SRT_NORMAL
set_component_parameter_value MEM_DDR3_PD_ENUM DDR3_PD_OFF
set_component_parameter_value MEM_DDR3_DRV_STR_ENUM DDR3_DRV_STR_RZQ_7
set_component_parameter_value MEM_DDR3_DLL_EN true
set_component_parameter_value MEM_DDR3_RTT_NOM_ENUM DDR3_RTT_NOM_ODT_DISABLED
set_component_parameter_value MEM_DDR3_RTT_WR_ENUM DDR3_RTT_WR_RZQ_4
set_component_parameter_value MEM_DDR3_WTCL 10
set_component_parameter_value MEM_DDR3_ATCL_ENUM DDR3_ATCL_DISABLED
set_component_parameter_value MEM_DDR3_TCL 14
set_component_parameter_value MEM_DDR3_USE_DEFAULT_ODT true
set_component_parameter_value MEM_DDR3_R_ODTN_1X1 {Rank 0}
set_component_parameter_value MEM_DDR3_R_ODT0_1X1 off
set_component_parameter_value MEM_DDR3_W_ODTN_1X1 {Rank 0}
set_component_parameter_value MEM_DDR3_W_ODT0_1X1 on
set_component_parameter_value MEM_DDR3_R_ODTN_2X2 {Rank 0,Rank 1}
set_component_parameter_value MEM_DDR3_R_ODT0_2X2 off,off
set_component_parameter_value MEM_DDR3_R_ODT1_2X2 off,off
set_component_parameter_value MEM_DDR3_W_ODTN_2X2 {Rank 0,Rank 1}
set_component_parameter_value MEM_DDR3_W_ODT0_2X2 on,off
set_component_parameter_value MEM_DDR3_W_ODT1_2X2 off,on
set_component_parameter_value MEM_DDR3_R_ODTN_4X2 {Rank 0,Rank 1,Rank 2,Rank 3}
set_component_parameter_value MEM_DDR3_R_ODT0_4X2 off,off,on,on
set_component_parameter_value MEM_DDR3_R_ODT1_4X2 on,on,off,off
set_component_parameter_value MEM_DDR3_W_ODTN_4X2 {Rank 0,Rank 1,Rank 2,Rank 3}
set_component_parameter_value MEM_DDR3_W_ODT0_4X2 off,off,on,on
set_component_parameter_value MEM_DDR3_W_ODT1_4X2 on,on,off,off
set_component_parameter_value MEM_DDR3_R_ODTN_4X4 {Rank 0,Rank 1,Rank 2,Rank 3}
set_component_parameter_value MEM_DDR3_R_ODT0_4X4 off,off,on,off
set_component_parameter_value MEM_DDR3_R_ODT1_4X4 off,off,off,on
set_component_parameter_value MEM_DDR3_R_ODT2_4X4 on,off,off,off
